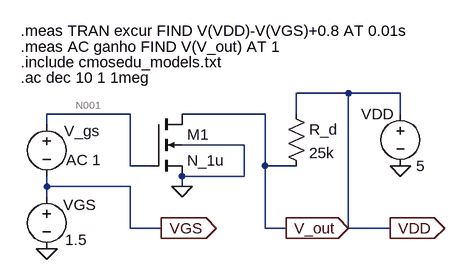
[diagram p0: schematic Parte 2 AC.asc]
Parte 2 AC.asc, the LTspice schematic file:
Version 4
SHEET 1 880 680
WIRE 256 -208 176 -208
WIRE 336 -208 256 -208
WIRE -80 -176 -208 -176
WIRE 128 -176 0 -176
WIRE 176 -176 176 -208
WIRE 336 -176 336 -208
WIRE -208 -160 -208 -176
WIRE 96 -128 0 -128
WIRE -80 -96 -80 -176
WIRE -48 -96 -80 -96
WIRE 128 -96 128 -176
WIRE 176 -96 128 -96
WIRE 96 -80 96 -128
WIRE 96 -80 0 -80
WIRE -208 -64 -208 -80
WIRE -80 -64 -208 -64
WIRE 0 -64 0 -80
WIRE -208 -48 -208 -64
WIRE -80 0 -80 -64
WIRE -32 0 -80 0
WIRE 128 0 128 -96
WIRE 160 0 128 0
WIRE 256 0 256 -208
WIRE 320 0 256 0
FLAG 336 -96 0
FLAG -208 32 0
FLAG 0 -64 0
FLAG 160 0 V_out
IOPIN 160 0 Out
FLAG -32 0 VGS
IOPIN -32 0 Out
FLAG 320 0 VDD
IOPIN 320 0 Out
SYMBOL nmos4 -48 -176 R0
SYMATTR InstName M1
SYMATTR Value N_1u
SYMATTR Value2 l=1.5u w=3u
SYMBOL voltage 336 -192 R0
WINDOW 0 -60 16 Left 2
WINDOW 123 0 0 Left 2
WINDOW 39 0 0 Left 2
SYMATTR InstName VDD
SYMATTR Value 5
SYMBOL voltage -208 -176 R0
WINDOW 123 30 71 Left 2
WINDOW 39 0 0 Left 2
WINDOW 0 27 26 Left 2
SYMATTR Value2 AC 1
SYMATTR InstName V_gs
SYMATTR Value ""
SYMBOL voltage -208 -64 R0
WINDOW 123 0 0 Left 2
WINDOW 39 0 0 Left 2
WINDOW 0 25 28 Left 2
WINDOW 3 28 82 Left 2
SYMATTR InstName VGS
SYMATTR Value 1.5
SYMBOL res 160 -192 R0
SYMATTR InstName R_d
SYMATTR Value 25k
TEXT -248 -256 Left 2 !.include cmosedu_models.txt
TEXT -248 -232 Left 2 !.ac dec 10 1 1meg
TEXT -248 -280 Left 2 !.meas AC ganho FIND V(V_out) AT 1
TEXT -248 -304 Left 2 !.meas TRAN excur FIND V(VDD)-V(VGS)+0.8 AT 0.01s

The netlist it stands for:
* Parte 2 AC.asc
M1 V_out N001 0 0 N_1u l=1.5u w=3u
VDD VDD 0 5
V_gs N001 VGS AC 1
VGS VGS 0 1.5
R_d VDD V_out 25k
.model NMOS NMOS
.model PMOS PMOS
.lib standard.mos
.include cmosedu_models.txt
.ac dec 10 1 1meg
.meas AC ganho FIND V(V_out) AT 1
.meas TRAN excur FIND V(VDD)-V(VGS)+0.8 AT 0.01s
.backanno
.end

* Results of the author's LTspice run, read from the files saved beside the schematic
* Operating Point, zero values left out:
*   V(v_out) = 3.975 V
*   V(n001) = 1.5 V
*   V(vdd) = 5 V
*   V(vgs) = 1.5 V
*   Id(M1) = 41.01 µA
*   Ib(M1) = -3.985 pA
*   Is(M1) = -41.01 µA
*   I(R_d) = 41.01 µA
*   I(Vdd) = -41.01 µA
* From the log:
*   ganho: v(v_out)=(7.63652dB,180°) at 1
*   excur: v(vdd)-v(vgs)+0.8=(-1.9382dB,0°) at 0.01